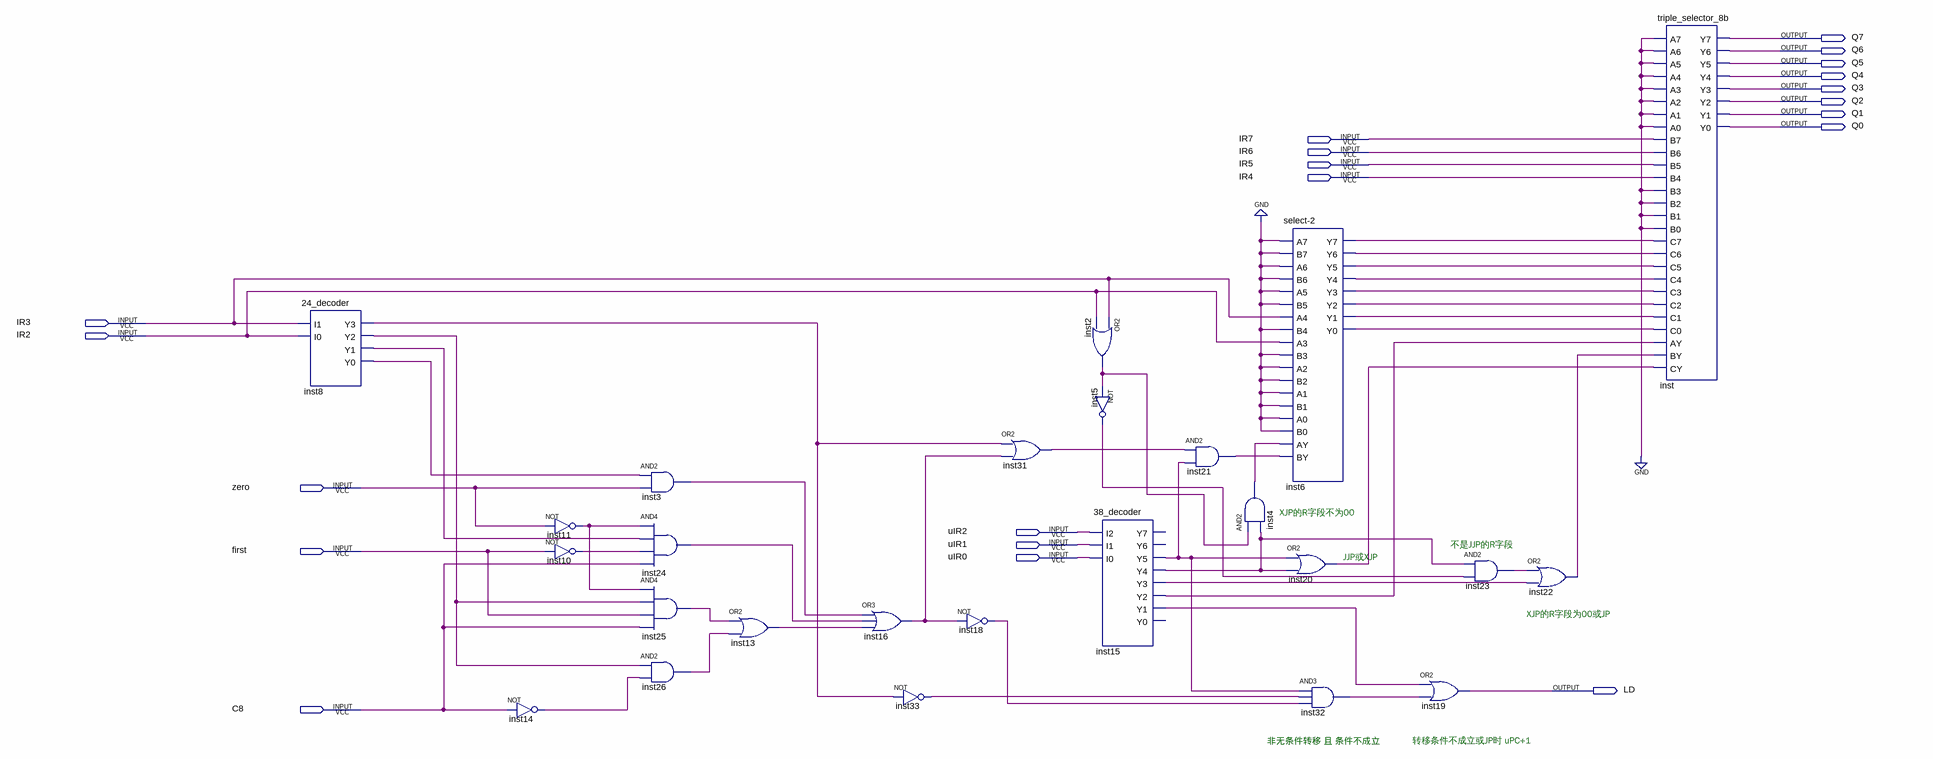
[diagram p0: schematic sheet]
// Quartus schematic MICRO_AD.bdf as structural Verilog: 25 symbols, 21 pins
module MICRO_AD (
  input  IR7,
  input  IR6,
  input  IR5,
  input  IR4,
  input  IR3,
  input  IR2,
  input  zero,
  input  uIR2,
  input  uIR1,
  input  first,
  input  uIR0,
  input  C8,
  output Q7,
  output Q6,
  output Q5,
  output Q4,
  output Q3,
  output Q2,
  output Q1,
  output Q0,
  output LD
);

  wire inst2_out, inst3_out, inst4_out, inst5_out, inst6_y0, inst6_y1, inst6_y2, inst6_y3, inst6_y4,
       inst6_y5, inst6_y6, inst6_y7, inst8_y0, inst8_y1, inst8_y2, inst8_y3, inst10_out, inst11_out,
       inst13_out, inst14_out, inst15_y1, inst15_y2, inst15_y3, inst15_y4, inst15_y5, inst16_out, inst18_out,
       inst20_out, inst21_out, inst22_out, inst23_out, inst24_out, inst25_out, inst26_out, inst31_out,
       inst32_out, inst33_out;

  \24_decoder  inst8 (.I1(IR3), .I0(IR2), .Y3(inst8_y3), .Y2(inst8_y2), .Y1(inst8_y1), .Y0(inst8_y0));
  not inst11 (inst11_out, zero);
  not inst10 (inst10_out, first);
  not inst14 (inst14_out, C8);
  and inst3 (inst3_out, inst8_y0, zero);
  and inst24 (inst24_out, inst11_out, inst8_y1, inst10_out, C8);
  and inst25 (inst25_out, inst11_out, inst8_y2, first, C8);
  and inst26 (inst26_out, inst8_y2, inst14_out);
  or inst13 (inst13_out, inst25_out, inst26_out);
  or inst16 (inst16_out, inst3_out, inst24_out, inst13_out);
  not inst33 (inst33_out, inst8_y3);
  or inst31 (inst31_out, inst8_y3, inst16_out);
  not inst18 (inst18_out, inst16_out);
  or inst2 (inst2_out, IR3, IR2);
  not inst5 (inst5_out, inst2_out);
  \38_decoder  inst15 (
    .I2(uIR2), .I1(uIR1), .I0(uIR0), .Y5(inst15_y5), .Y4(inst15_y4), .Y3(inst15_y3), .Y2(inst15_y2),
    .Y1(inst15_y1));  // open: Y7, Y6, Y0
  and inst21 (inst21_out, inst31_out, inst15_y5);
  and inst4 (inst4_out, inst2_out, inst15_y4);
  \select-2  inst6 (
    .A7(1'b0), .B7(1'b0), .A6(1'b0), .B6(1'b0), .A5(1'b0), .B5(1'b0), .A4(IR3), .B4(1'b0), .A3(IR2),
    .B3(1'b0), .A2(1'b0), .B2(1'b0), .A1(1'b0), .B1(1'b0), .A0(1'b0), .B0(1'b0), .AY(inst4_out),
    .BY(inst21_out), .Y7(inst6_y7), .Y6(inst6_y6), .Y5(inst6_y5), .Y4(inst6_y4), .Y3(inst6_y3),
    .Y2(inst6_y2), .Y1(inst6_y1), .Y0(inst6_y0));
  or inst20 (inst20_out, inst15_y5, inst15_y4);
  and inst32 (inst32_out, inst15_y5, inst33_out, inst18_out);
  or inst19 (LD, inst15_y1, inst32_out);
  and inst23 (inst23_out, inst15_y4, inst5_out);
  or inst22 (inst22_out, inst23_out, inst15_y3);
  triple_selector_8b inst (
    .A7(1'b0), .B7(IR7), .C7(inst6_y7), .A6(1'b0), .B6(IR6), .C6(inst6_y6), .A5(1'b0), .B5(IR5),
    .C5(inst6_y5), .A4(1'b0), .B4(IR4), .C4(inst6_y4), .A3(1'b0), .B3(1'b0), .C3(inst6_y3), .A2(1'b0),
    .B2(1'b0), .C2(inst6_y2), .A1(1'b0), .B1(1'b0), .C1(inst6_y1), .A0(1'b0), .B0(1'b0), .C0(inst6_y0),
    .AY(inst15_y2), .BY(inst22_out), .CY(inst20_out), .Y7(Q7), .Y6(Q6), .Y5(Q5), .Y4(Q4), .Y3(Q3), .Y2(Q2),
    .Y1(Q1), .Y0(Q0));

  // Notes on the sheet:
  //   XJP的R字段不为00
  //   不是JJP的R字段
  //   JJP或XJP
  //   XJP的R字段为00或JP
  //   非无条件转移 且 条件不成立
  //   转移条件不成立或JP时 uPC+1
endmodule
